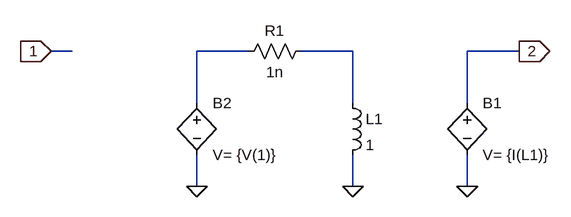
[diagram p0: schematic Integrate.asc]
Integrate.asc, the LTspice schematic file:
Version 4
SHEET 1 880 680
WIRE -176 48 -208 48
WIRE 96 48 16 48
WIRE 256 48 176 48
WIRE 512 48 432 48
WIRE 16 128 16 48
WIRE 256 128 256 48
WIRE 432 128 432 48
WIRE 16 256 16 208
WIRE 256 256 256 208
WIRE 432 256 432 208
FLAG -208 48 1
IOPIN -208 48 In
FLAG 512 48 2
IOPIN 512 48 Out
FLAG 432 256 0
FLAG 16 256 0
FLAG 256 256 0
SYMBOL bv 432 112 R0
SYMATTR InstName B1
SYMATTR Value V= {I(L1)}
SYMBOL bv 16 112 R0
SYMATTR InstName B2
SYMATTR Value V= {V(1)}
SYMBOL res 192 32 R90
WINDOW 0 0 56 VBottom 2
WINDOW 3 32 56 VTop 2
SYMATTR InstName R1
SYMATTR Value 1n
SYMBOL ind 240 112 R0
SYMATTR InstName L1
SYMATTR Value 1

The netlist it stands for:
* Integrate.asc
B1 2 0 V= {I(L1)}
B2 N001 0 V= {V(1)}
R1 N002 N001 1n
L1 N002 0 1
.backanno
.end